# Altium schematic sheet RadYaab_v1.SchDoc
size 533 x 342 mm
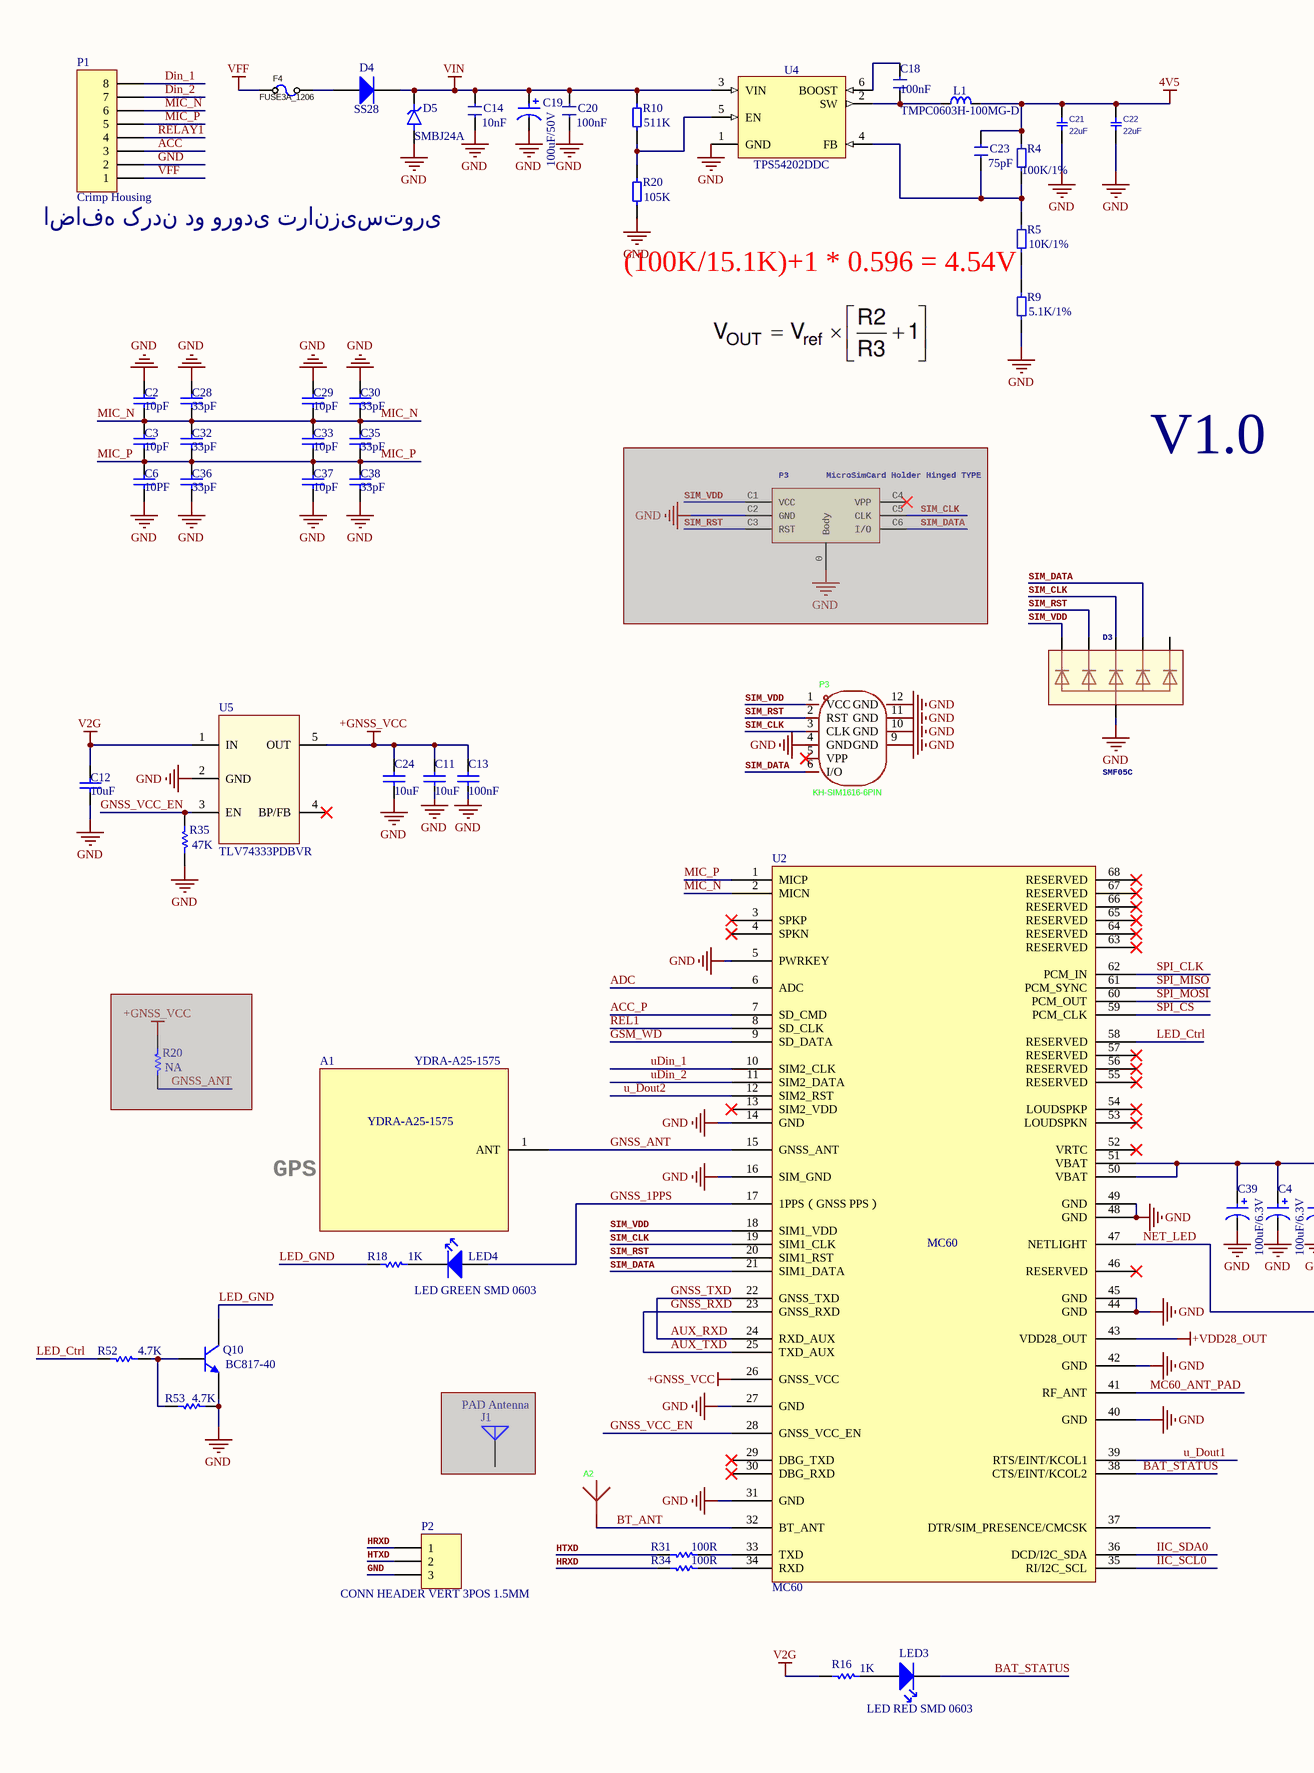
[diagram p0: RadYaab_v1.SchDoc, left]
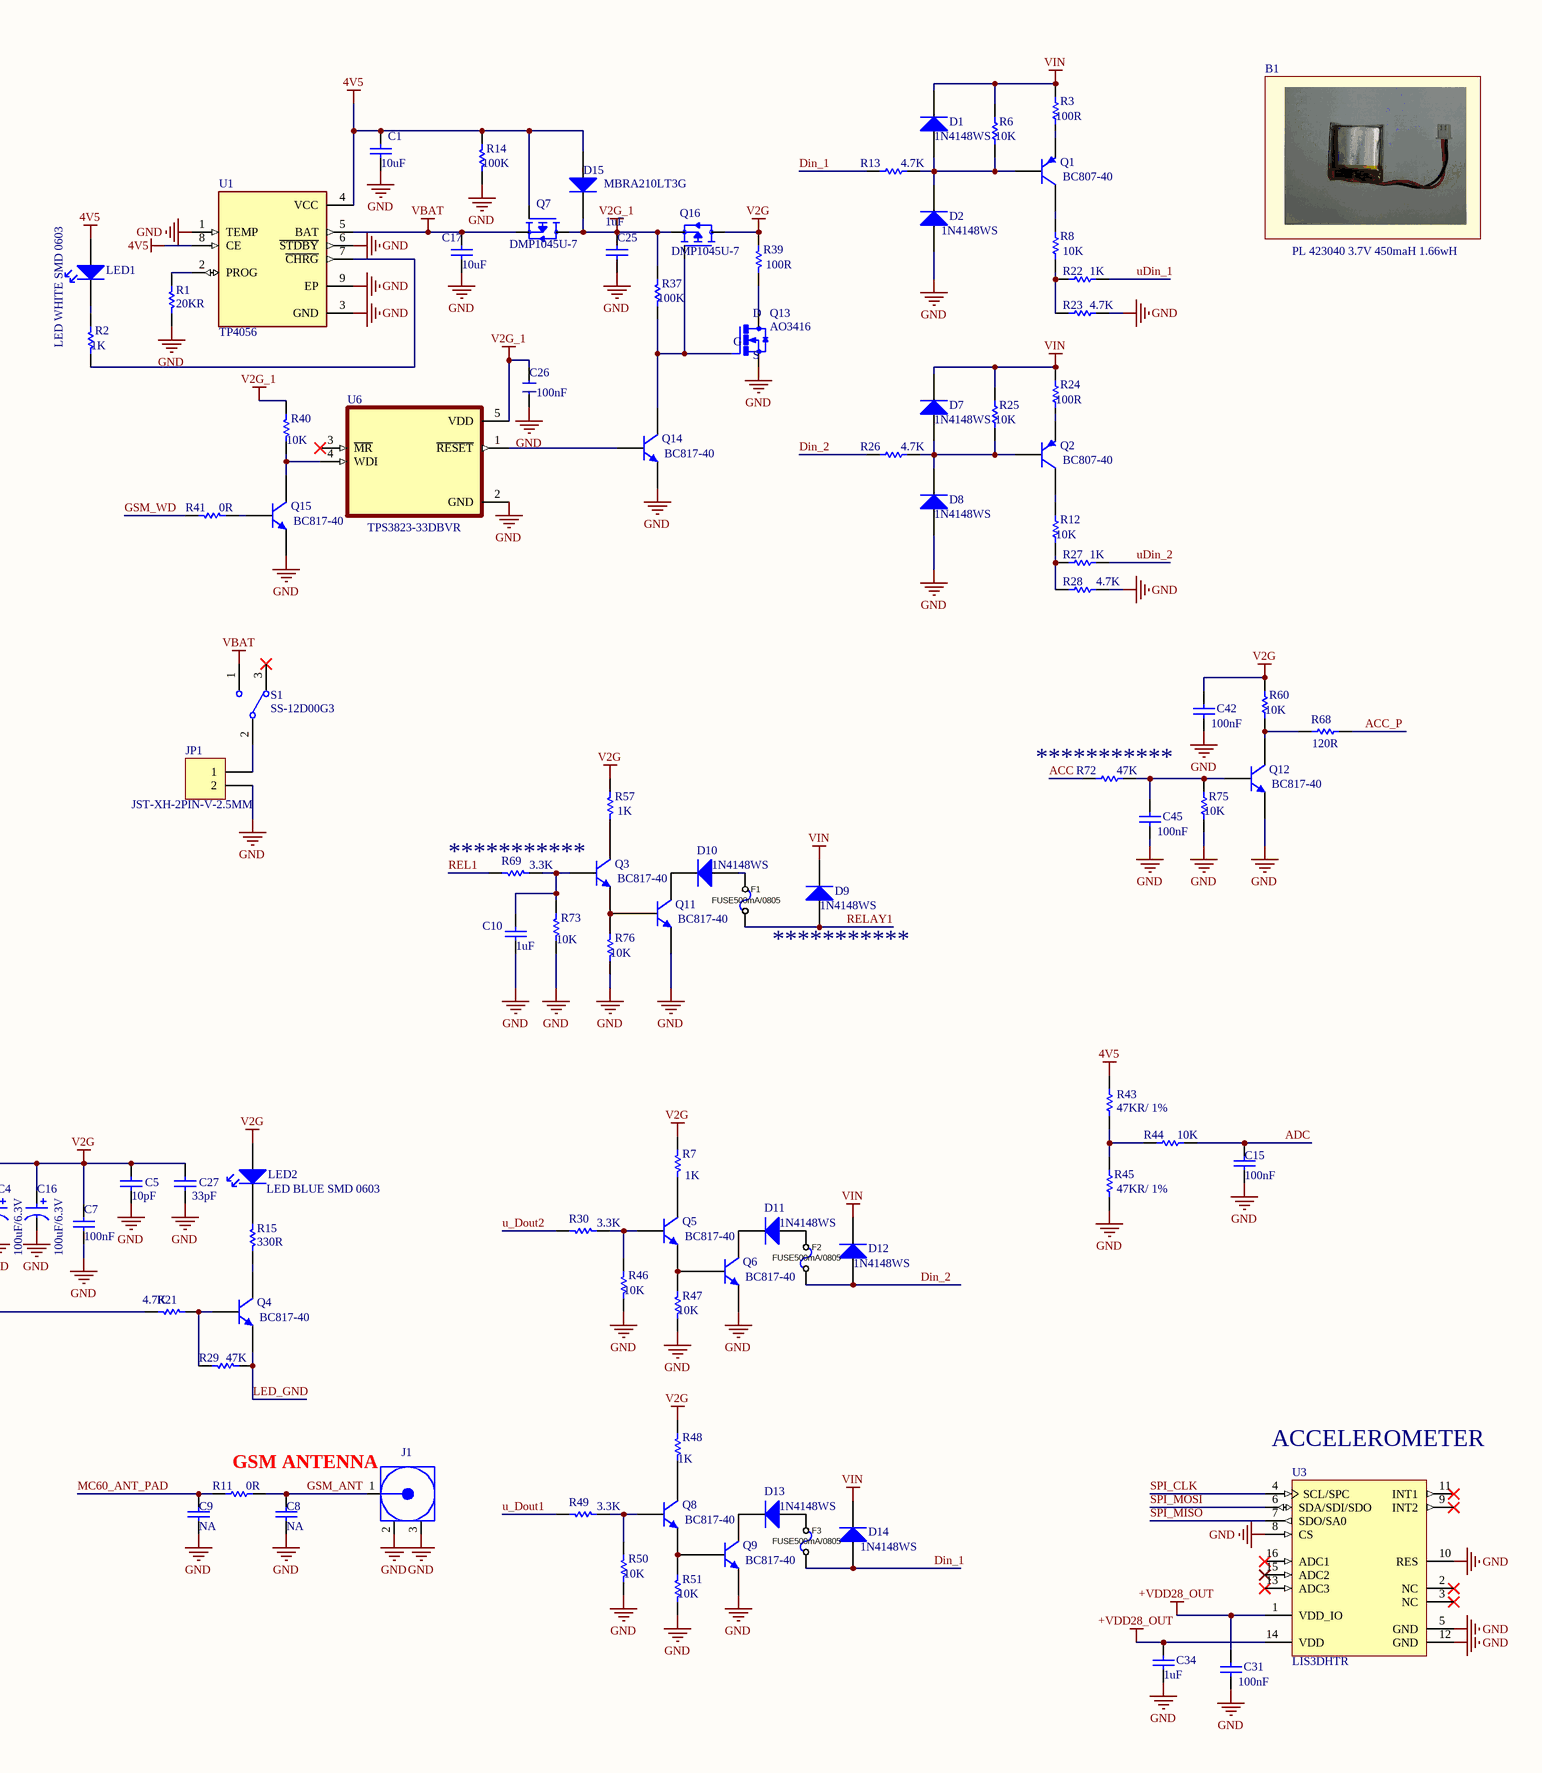
[diagram p1: RadYaab_v1.SchDoc, right]

## Parts
(Parts that share a designator on the sheet are numbered #1, #2 ... from top to bottom, then left to right.)
A1  YDRA-A25-1575  [YDRA-A25-1575]
A2  2450AT18A100E  [ANT-SMD_L3.2-W1.6]  (value not drawn)
B1  PL 423040 3.7V 450maH 1.66wH  [3.7V-450mAh]
C1  10uF  [C_0603 (1608 Metric)]
C2  10pF  [C_0603 (1608 Metric)]
C3  10pF  [C_0603 (1608 Metric)]
C4  100uF/6.3V  [Tantalum-B]
C5  10pF  [C_0603 (1608 Metric)]
C6  10PF  [C_0603 (1608 Metric)]
C7  100nF  [C_0603 (1608 Metric)]
C8  NA  [C0402]  (no BOM)
C9  NA  [C0402]  (no BOM)
C10  1uF  [C_0603 (1608 Metric)]
C11  10uF  [C_0805 (2012 Metric)]
C12  10uF  [C_0805 (2012 Metric)]
C13  100nF  [C_0603 (1608 Metric)]
C14  10nF  [C_0603 (1608 Metric)]
C15  100nF  [C_0603 (1608 Metric)]
C16  100uF/6.3V  [Tantalum-B]
C17  10uF  [C_0603 (1608 Metric)]
C18  100nF  [C_0603 (1608 Metric)]
C19  100uF/50V  [CAP-16-5-3.5MM]
C20  100nF  [C_0603 (1608 Metric)]
C21  22uF  [C1206E]
C22  22uF  [C1206E]
C23  75pF  [C_0603 (1608 Metric)]
C24  10uF  [C_0805 (2012 Metric)]
C25  1uF  [C_0603 (1608 Metric)]
C26  100nF  [C_0603 (1608 Metric)]
C27  33pF  [C_0603 (1608 Metric)]
C28  33pF  [C_0603 (1608 Metric)]
C29  10pF  [C_0603 (1608 Metric)]
C30  33pF  [C_0603 (1608 Metric)]
C31  100nF  [C_0603 (1608 Metric)]
C32  33pF  [C_0603 (1608 Metric)]
C33  10pF  [C_0603 (1608 Metric)]
C34  1uF  [C_0603 (1608 Metric)]
C35  33pF  [C_0603 (1608 Metric)]
C36  33pF  [C_0603 (1608 Metric)]
C37  10pF  [C_0603 (1608 Metric)]
C38  33pF  [C_0603 (1608 Metric)]
C39  100uF/6.3V  [Tantalum-B]
C42  100nF  [C_0603 (1608 Metric)]
C45  100nF  [C_0603 (1608 Metric)]
D1  1N4148WS  [D_SOD123W]
D2  1N4148WS  [D_SOD123W]
D3  SMF05C  [SOT363]
D4  SS28  [DO-214AA]
D5  SMBJ24A  [DIOM5436X261N]
D7  1N4148WS  [D_SOD123W]
D8  1N4148WS  [D_SOD123W]
D9  1N4148WS  [D_SOD123W]
D10  1N4148WS  [D_SOD123W]
D11  1N4148WS  [D_SOD123W]
D12  1N4148WS  [D_SOD123W]
D13  1N4148WS  [D_SOD123W]
D14  1N4148WS  [D_SOD123W]
D15  MBRA210LT3G  [DO-214AC]
F1  FUSE500mA/0805  [F0805]
F2  FUSE500mA/0805  [F0805]
F3  FUSE500mA/0805  [F0805]
F4  FUSE3A_1206  [F1206]
J1#1  PAD Antenna  [Bluetooth_ANT]  (no BOM)  (masked out: inside a compile mask, not in the netlist)
J1#2  636101111001  [63610111x001]  (value not drawn)
JP1  JST-XH-2PIN-V-2.5MM  [BT-CON]  (no BOM)
L1  TMPC0603H-100MG-D  [IND-SMD_L7.3-W6.6]
LED1  LED WHITE SMD 0603  [LED-0603 (1608 Metric)]
LED2  LED BLUE SMD 0603  [LED-0603 (1608 Metric)]
LED3  LED RED SMD 0603  [LED-0603 (1608 Metric)]
LED4  LED GREEN SMD 0603  [LED-0603 (1608 Metric)]
P1  Crimp Housing  [CON-8]
P2  CONN HEADER VERT 3POS 1.5MM  [JST_ZH_3Pin_150mm]
P3#1  MicroSimCard Holder Hinged TYPE  [MicroSimCard_Holder_Hinged]  (masked out: inside a compile mask, not in the netlist)
P3#2  KH-SIM1616-6PIN  [MICRO-SIM-SMD_KH-SIM1616-6PIN]
Q1  BC807-40  [SOT-23-3]
Q2  BC807-40  [SOT-23-3]
Q3  BC817-40  [SOT-23-3]
Q4  BC817-40  [SOT-23-3]
Q5  BC817-40  [SOT-23-3]
Q6  BC817-40  [SOT-23-3]
Q7  DMP1045U-7  [SOT95P237X112-3N]
Q8  BC817-40  [SOT-23-3]
Q9  BC817-40  [SOT-23-3]
Q10  BC817-40  [SOT-23-3]
Q11  BC817-40  [SOT-23-3]
Q12  BC817-40  [SOT-23-3]
Q13  AO3416  [SOT23-3]
Q14  BC817-40  [SOT-23-3]
Q15  BC817-40  [SOT-23-3]
Q16  DMP1045U-7  [SOT95P237X112-3N]
R1  20KR  [R_0603 (1608 Metric)]
R2  1K  [R_0603 (1608 Metric)]
R3  100R  [R_0603 (1608 Metric)]
R4  100K/1%  [R_0603 (1608 Metric)]
R5  10K/1%  [R_0603 (1608 Metric)]
R6  10K  [R_0603 (1608 Metric)]
R7  1K  [R_0603 (1608 Metric)]
R8  10K  [R_0603 (1608 Metric)]
R9  5.1K/1%  [R_0603 (1608 Metric)]
R10  511K  [R_0603 (1608 Metric)]
R11  0R  [R0402]
R12  10K  [R_0603 (1608 Metric)]
R13  4.7K  [R_0603 (1608 Metric)]
R14  100K  [R_0603 (1608 Metric)]
R15  330R  [R_0603 (1608 Metric)]
R16  1K  [R_0603 (1608 Metric)]
R18  1K  [R_0603 (1608 Metric)]
R20#1  105K  [R_0603 (1608 Metric)]
R20#2  NA  [R_0603 (1608 Metric)]  (no BOM)  (masked out: inside a compile mask, not in the netlist)
R21  4.7K  [R_0603 (1608 Metric)]
R22  1K  [R_0603 (1608 Metric)]
R23  4.7K  [R_0603 (1608 Metric)]
R24  100R  [R_0603 (1608 Metric)]
R25  10K  [R_0603 (1608 Metric)]
R26  4.7K  [R_0603 (1608 Metric)]
R27  1K  [R_0603 (1608 Metric)]
R28  4.7K  [R_0603 (1608 Metric)]
R29  47K  [R_0603 (1608 Metric)]
R30  3.3K  [R_0603 (1608 Metric)]
R31  100R  [R_0603 (1608 Metric)]
R34  100R  [R_0603 (1608 Metric)]
R35  47K  [R_0603 (1608 Metric)]
R37  100K  [R_0603 (1608 Metric)]
R39  100R  [R0805]
R40  10K  [R_0603 (1608 Metric)]
R41  0R  [R_0603 (1608 Metric)]
R43  47KR/ 1%  [R_0603 (1608 Metric)]
R44  10K  [R_0603 (1608 Metric)]
R45  47KR/ 1%  [R_0603 (1608 Metric)]
R46  10K  [R_0603 (1608 Metric)]
R47  10K  [R_0603 (1608 Metric)]
R48  1K  [R_0603 (1608 Metric)]
R49  3.3K  [R_0603 (1608 Metric)]
R50  10K  [R_0603 (1608 Metric)]
R51  10K  [R_0603 (1608 Metric)]
R52  4.7K  [R_0603 (1608 Metric)]
R53  4.7K  [R_0603 (1608 Metric)]
R57  1K  [R_0603 (1608 Metric)]
R60  10K  [R_0603 (1608 Metric)]
R68  120R  [R_0603 (1608 Metric)]
R69  3.3K  [R_0603 (1608 Metric)]
R72  47K  [R_0603 (1608 Metric)]
R73  10K  [R_0603 (1608 Metric)]
R75  10K  [R_0603 (1608 Metric)]
R76  10K  [R_0603 (1608 Metric)]
S1  SS-12D00G3  [SW-TH_SS-12D01-GX]
U1  TP4056  [SOP127P600X175-9N]
U2  MC60  [MOD-54_ExtraPins]
U3  LIS3DHTR  [PQFN50P300X300X79-16N]
U4  TPS54202DDC  [SOT95P280X100-6N]
U5  TLV74333PDBVR  [SOT23-5]
U6  TPS3823-33DBVR  [SOT95P280X145-5N]

## Nets
4V5: C1.2 C21.2 C22.2 C23.2 D15.1(A) L1.2 LED1.1(A) Q7.1(G) R4.1 R14.1 R43.2 U1.4(VCC) U1.8(CE)
+GNSS_VCC: C11.2 C13.2 C24.2 U2.26(GNSS_VCC) U5.5(OUT)
+VDD28_OUT: C31.2 C34.2 U2.43(VDD28_OUT) U3.1(VDD_IO) U3.14(VDD)
GND: C1.1 C2.1 C4.2 C5.1 C6.2 C7.1 C8.1 C9.1 C10.1 C11.1 C12.1 C13.1 C14.1 C15.1 C16.2 C17.1 C19.2 C20.1 C21.1 C22.1 C24.1 C25.1 C26.2 C27.1 C28.1 C29.1 C30.1 C31.1 C34.1 C36.2 C37.2 C38.2 C39.2 C42.1 C45.1 D2.1(A) D3.2(A) D5.A D8.1(A) J1#2.2(GND) J1#2.3(GND) JP1.2 P1.2 P2.3 P3#2.4(GND) P3#2.9(GND) P3#2.10(GND) P3#2.11(GND) P3#2.12(GND) Q6.2(E) Q9.2(E) Q10.2(E) Q11.2(E) Q12.2(E) Q13.2(S) Q14.2(E) Q15.2(E) R1.1 R9.2 R14.2 R20#1.2 R23.1 R28.1 R35.2 R45.1 R46.1 R47.1 R50.1 R51.1 R53.1 R73.1 R75.2 R76.1 U1.1(TEMP) U1.3(GND) U1.6(~{STDBY}) U1.9(EP) U2.5(PWRKEY) U2.14(GND) U2.16(SIM_GND) U2.27(GND) U2.31(GND) U2.40(GND) U2.42(GND) U2.44(GND) U2.45(GND) U2.48(GND) U2.49(GND) U3.5(GND) U3.8(CS) U3.10(RES) U3.12(GND) U4.1(GND) U5.2(GND) U6.2(GND)
V2G: C4.1 C5.2 C7.2 C12.2 C16.1 C27.2 C39.1 C42.2 LED2.1(A) Q16.3(D) R7.2 R16.1 R39.2 R48.2 R57.2 R60.2 U2.50(VBAT) U2.51(VBAT) U5.1(IN)
V2G_1: C25.2 C26.1 D15.2(K) Q7.3(D) Q16.2(S) R37.2 R40.2 U6.5(VDD)
VBAT: C17.2 Q7.2(S) S1.1 U1.5(BAT)
VFF: F4.1 P1.1
VIN: C14.2 C19.1 C20.2 D1.2(K) D4.2(K) D5.C D7.2(K) D9.2(K) D12.2(K) D14.2(K) R3.2 R6.1 R10.1 R24.2 R25.1 U4.3(VIN)
ACC: P1.3 R72.2
ACC_P: R68.2 U2.7(SD_CMD)
ADC: C15.2 R44.2 U2.6(ADC)
AUX_RXD: U2.22(GNSS_TXD) U2.24(RXD_AUX)  [also labelled GNSS_TXD]
AUX_TXD: U2.23(GNSS_RXD) U2.25(TXD_AUX)  [also labelled GNSS_RXD]
BAT_STATUS: LED3.2(K) U2.38(CTS/EINT/KCOL2)
BT_ANT: A2.1(ANT) U2.32(BT_ANT)
Din_1: D14.1(A) F3.1 P1.8 R13.2
Din_2: D12.1(A) F2.1 P1.7 R26.2
GNSS_1PPS: LED4.1(A) U2.17(1PPS（GNSS_PPS）)
GNSS_ANT: A1.1(ANT) U2.15(GNSS_ANT)
GNSS_VCC_EN: R35.1 U2.28(GNSS_VCC_EN) U5.3(EN)
GSM_ANT: C8.2 J1#2.1(Signal) R11.1
GSM_WD: R41.2 U2.9(SD_DATA)
HRXD: P2.1 R34.2
HTXD: P2.2 R31.2
IIC_SCL0: U2.35(RI/I2C_SCL)
IIC_SDA0: U2.36(DCD/I2C_SDA)
LED_Ctrl: R52.2 U2.58(RESERVED)
LED_GND: Q4.2(E) Q10.3(C) R18.2 R29.1
MC60_ANT_PAD: C9.2 R11.2 U2.41(RF_ANT)
MIC_N: C2.2 C3.2 C28.2 C29.2 C30.2 C32.2 C33.2 C35.2 P1.6 U2.2(MICN)
MIC_P: C3.1 C6.1 C32.1 C33.1 C35.1 C36.1 C37.1 C38.1 P1.5 U2.1(MICP)
NET_LED: R21.2 U2.47(NETLIGHT)
REL1: R69.1 U2.8(SD_CLK)
RELAY1: D9.1(A) F1.1 P1.4
SIM_CLK: D3.4(C3) P3#2.3(CLK) U2.19(SIM1_CLK)
SIM_DATA: D3.5(C4) P3#2.6(I/O) U2.21(SIM1_DATA)
SIM_RST: D3.3(C2) P3#2.2(RST) U2.20(SIM1_RST)
SIM_VDD: D3.1(C1) P3#2.1(VCC) U2.18(SIM1_VDD)
SPI_CLK: U2.62(PCM_IN) U3.4(SCL/SPC)
SPI_CS: U2.59(PCM_CLK)
SPI_MISO: U2.61(PCM_SYNC) U3.7(SDO/SA0)
SPI_MOSI: U2.60(PCM_OUT) U3.6(SDA/SDI/SDO)
u_Dout1: R49.1 U2.39(RTS/EINT/KCOL1)
u_Dout2: R30.1 U2.12(SIM2_RST)
uDin_1: R22.2 U2.10(SIM2_CLK)
uDin_2: R27.2 U2.11(SIM2_DATA)
NetC10_2: C10.2 Q3.1(B) R69.2 R73.2
NetC18_1: C18.1 U4.6(BOOST)
NetC18_2: C18.2 L1.1 U4.2(SW)
NetC23_1: C23.1 R4.2 R5.1 U4.4(FB)
NetC45_2: C45.2 Q12.1(B) R72.1 R75.1
NetD1_1: D1.1(A) D2.2(K) Q1.1(B) R6.2 R13.1
NetD4_1: D4.1(A) F4.2
NetD7_1: D7.1(A) D8.2(K) Q2.1(B) R25.2 R26.1
NetD10_1: D10.1(A) F1.2
NetD10_2: D10.2(K) Q11.3(C)
NetD11_1: D11.1(A) F2.2
NetD11_2: D11.2(K) Q6.3(C)
NetD13_1: D13.1(A) F3.2
NetD13_2: D13.2(K) Q9.3(C)
NetJP1_1: JP1.1 S1.2
NetLED1_2: LED1.2(K) R2.1
NetLED2_2: LED2.2(K) R15.1
NetLED3_1: LED3.1(A) R16.2
NetLED4_2: LED4.2(K) R18.1
NetQ1_2: Q1.2(E) R3.1
NetQ1_3: Q1.3(C) R8.2
NetQ2_2: Q2.2(E) R24.1
NetQ2_3: Q2.3(C) R12.2
NetQ3_2: Q3.2(E) Q11.1(B) R76.2
NetQ3_3: Q3.3(C) R57.1
NetQ4_1: Q4.1(B) R21.1 R29.2
NetQ4_3: Q4.3(C) R15.2
NetQ5_1: Q5.1(B) R30.2 R46.2
NetQ5_2: Q5.2(E) Q6.1(B) R47.2
NetQ5_3: Q5.3(C) R7.1
NetQ8_1: Q8.1(B) R49.2 R50.2
NetQ8_2: Q8.2(E) Q9.1(B) R51.2
NetQ8_3: Q8.3(C) R48.1
NetQ10_1: Q10.1(B) R52.1 R53.2
NetQ12_3: Q12.3(C) R60.1 R68.1
NetQ13_1: Q13.1(G) Q14.3(C) Q16.1(G) R37.1
NetQ13_3: Q13.3(D) R39.1
NetQ14_1: Q14.1(B) U6.1(~{RESET})
NetQ15_1: Q15.1(B) R41.1
NetQ15_3: Q15.3(C) R40.1 U6.4(WDI)
NetR1_2: R1.2 U1.2(PROG)
NetR2_2: R2.2 U1.7(~{CHRG})
NetR5_2: R5.2 R9.1
NetR8_1: R8.1 R22.1 R23.2
NetR10_2: R10.2 R20#1.1 U4.5(EN)
NetR12_1: R12.1 R27.1 R28.2
NetR31_1: R31.1 U2.33(TXD)
NetR34_1: R34.1 U2.34(RXD)
NetR43_1: R43.1 R44.1 R45.2

Not connected (* = marked no-connect by the designer): A2 2; D3 6(C5); P3#2 5(VPP)*; S1 3*; U2 3(SPKP)* 4(SPKN)* 13(SIM2_VDD)* 29(DBG_TXD)* 30(DBG_RXD)* 37(DTR/SIM_PRESENCE/CMCSK) 46(RESERVED)* 52(VRTC)* 53(LOUDSPKN)* 54(LOUDSPKP)* 55(RESERVED)* 56(RESERVED)* 57(RESERVED)* 63(RESERVED)* 64(RESERVED)* 65(RESERVED)* 66(RESERVED)* 67(RESERVED)* 68(RESERVED)*; U3 2(NC)* 3(NC)* 9(INT2)* 11(INT1)* 13(ADC3)* 15(ADC2)* 16(ADC1)*; U5 4(BP/FB)*; U6 3(~{MR})*

## Notes on the sheet
- (near P1) اضافه کردن دو ورودی ترانزیستوری
- (near R5) (100K/15.1K)+1 * 0.596 = 4.54V
- V1.0
- (near R72) ***********
- (near R69) ***********
- ***********
- GPS Antenna
- GSM ANTENNA
- (near U3) ACCELEROMETER

## Library data of the parts
A1 = YDRA-A25-1575: 25x25mm GPS ceramic patch antenna; Manufacturer: Amotech; Board Qty: 1000; Current Footprint: NULL; PCB Name: GS-101; HelpURL: D:\HNA\ALTIUM2009\GS-101\DOC\Datasheet_YDRA-A25-1575 (Rev 0).pdf; Part Number: YDRA-A25-1575; ITEM/NO: NULL; Manufacturer Part Number: NULL; Package / Case: NULL; Pricing: NULL; Size / Dimension: NULL; Supplier: NULL; Supplier Part Number: NULL
A2 = 2450AT18A100E: Manufacturer: JOHANSON(约翰逊); Add into BOM: yes; Antenna Type: 2.4G天线; Central Frequency: 2.4GHz; Peak Gain: 0.5dBi; Impedance: 50Ω; Power capacity: 2W; Symbol: 2450AT18A100E; Device: 2450AT18A100E; LCSC Part Name: 2.4G天线; Supplier Part: C89334; Manufacturer Part: 2450AT18A100E; Supplier Footprint: 1206; JLCPCB Part Class: Extended Part; Datasheet: https://atta.szlcsc.com/upload/public/pdf/source/20180301/C89334_15198946260391384223.pdf; Supplier: LCSC; Convert to PCB: yes; Bandwidth: -; Polarization Type: -; VSWR: -; Operating Temperature: -40℃~+125℃
B1 = Battery 3.7V 1000mah: Battery 3.7V 450mAh with PCB Rechargeable Li-Polymer Battery; Board Qty: 1000; Current Footprint: NULL; PCB Name: GS-101; Part Number: PL 423040 3.7V 450maH 1.66wH; ITEM/NO: NULL; Manufacturer Part Number: NULL; Package / Case: NULL; Pricing: NULL; Size / Dimension: 29.5MM*38MM*4MM; Supplier: NULL; Supplier Part Number: NULL; Manufacturer: NULL
C1 C11 C17 C24 = Cap_SMD: Chip Monolithic Ceramic Capacitor; SMD; Manufacturer: Vishay or Panasonic; Manufacturer Part Number: NULL; Current Footprint: 0805 (2012 Metric); Board Qty: 1000; PCB Name: GS-101; ITEM/NO: 23; Package / Case: 0805 (2012 Metric); Part Number: 10uF; Pricing: NULL; Size / Dimension: NULL; Supplier: NULL; Supplier Part Number: NULL
C2 C6 C28-C30 C36-C38 = Cap: Chip Monolithic Ceramic Capacitor; SMD; Manufacturer: Vishay or Panasonic; Manufacturer Part Number: NULL; Board Qty: 1000; Current Footprint: 0603 (1608 Metric); PCB Name: GS-101; ITEM/NO: 35; ComponentLink1Description: Datasheet; ComponentLink1URL: D:\HNA\Datasheet Documents\KEM_C1002_X7R_SMD.pdf; Description1: Chip Monolithic Ceramic Capacitor; SMD; HelpURL: D:\HNA\Datasheet Documents\KEM_C1002_X7R_SMD.pdf; Mounting Type: Surface Mount; Package / Case: 0603 (1608 Metric); Pricing: NULL; Supplier: NULL; Supplier Part Number: NULL; Size / Dimension: NULL
  C2 C6 C29 C37: Part Number: 10PF
  C28 C30 C36 C38: Part Number: 33PF
C3 C32 C33 C35 = Cap: Chip Monolithic Ceramic Capacitor; SMD; Manufacturer: Vishay or Panasonic; Manufacturer Part Number: NULL; Board Qty: 1000; Current Footprint: 0603 (1608 Metric); PCB Name: GS-101; ITEM/NO: 46; ComponentLink1Description: Datasheet; ComponentLink1URL: D:\HNA\Datasheet Documents\KEM_C1002_X7R_SMD.pdf; Description1: Chip Monolithic Ceramic Capacitor; SMD; HelpURL: D:\HNA\Datasheet Documents\KEM_C1002_X7R_SMD.pdf; Mounting Type: Surface Mount; Package / Case: 0603 (1608 Metric); Pricing: NULL; Supplier: NULL; Supplier Part Number: NULL; Size / Dimension: NULL
  C3 C33: Part Number: 10PF
  C32 C35: Part Number: 33PF
C4 C16 C39 = Cap Pol SMD: CAP TANT 22UF 10% 16V SMD; Manufacturer: AVX Corporation; Manufacturer Part Number: TAJB226K016RNJ; Manufacturer Size Code: B; Current Footprint: 1411 (3528 Metric), 1210; Board Qty: 1000; Type: Molded; ESR (Equivalent Series Resistance): 2.3 Ohm; Notification: Current market demand for these product types have resulted in fluctuating and extending lead times. Lead times may differ.; ITEM/NO: NULL; PCB Name: GS-101; Part Number: 100uF/6.3V; HelpURL: D:\HNA\Datasheet Documents\TAJ.pdf; Supplier 1: Digi-Key; Supplier Part Number 1: 478-1682-2-ND; RoHS: RoHS Compliant; Category: Capacitors; Stock 1: 84000; Pricing 1: 2000=0.1344, 4000=0.126, 10000=0.1176, 14000=0.116 (USD); Packaging: Tape & Reel (TR); Part Status: Active; Tolerance: ±10%; Operating Temperature: -55°C ~ 125°C; Lifetime @ Temp.: -; Mounting Type: Surface Mount; Package / Case: 1411 (3528 Metric), 1210; Size / Dimension: 0.138" L x 0.110" W (3.50mm x 2.80mm); Height - Seated (Max): 0.083" (2.10mm); Lead Spacing: -; Features: General Purpose; Failure Rate: -; ComponentLink1URL: http://datasheets.avx.com/TAJ.pdf; ComponentLink1Description: http://datasheets.avx.com/TAJ.pdf; Pricing: NULL; Supplier: NULL; Supplier Part Number: NULL; Parameter 1: *
C5 C8-C10 C12 C25 C27 C31 C42 C45 = Cap: Chip Monolithic Ceramic Capacitor; SMD; Manufacturer: NULL; Current Footprint: 0603 (1608 Metric); Board Qty: 1000; PCB Name: GS-101; ITEM/NO: 44; Manufacturer Part Number: NULL; Package / Case: 0603 (1608 Metric); Pricing: NULL; Size / Dimension: NULL; Supplier: NULL; Supplier Part Number: NULL
  C5: Part Number: 10pF
  C8 C9: Part Number: NA
  C10 C25: Part Number: 1uF
  C12: Part Number: 10uF
  C27: Part Number: 33pF
  C31 C42 C45: Part Number: 100nF
C7 = Cap: Chip Monolithic Ceramic Capacitor; SMD; Manufacturer: Vishay or Panasonic; Manufacturer Part Number: NULL; Board Qty: 1000; Current Footprint: 0603 (1608 Metric); PCB Name: GS-101; ITEM/NO: 44; Part Number: 100nF; ComponentLink1Description: Datasheet; ComponentLink1URL: D:\HNA\Datasheet Documents\KEM_C1002_X7R_SMD.pdf; Description1: Chip Monolithic Ceramic Capacitor; SMD; HelpURL: D:\HNA\Datasheet Documents\KEM_C1002_X7R_SMD.pdf; Mounting Type: Surface Mount; Package / Case: 0603 (1608 Metric); Pricing: NULL; Supplier: NULL; Supplier Part Number: NULL; Size / Dimension: NULL
C13 C15 = Cap_SMD: Chip Monolithic Ceramic Capacitor; SMD; Manufacturer: Vishay or Panasonic; Manufacturer Part Number: NULL; Current Footprint: 0603 (1608 Metric); Board Qty: 1000; PCB Name: GS-101; ITEM/NO: 44; Package / Case: 0603 (1608 Metric); Part Number: 100nF; Pricing: NULL; Size / Dimension: NULL; Supplier: NULL; Supplier Part Number: NULL
C14 C18 C20 C23 C26 = Capacitor SMD
  C14: Value: 10nF
  C18 C20 C26: Value: 100nF
  C23: Value: 75pF
C19 = Cap Pol THD: CAP ALUM 100UF 20% 50V RADIAL; Manufacturer: KEMET; Manufacturer Part Number: ESY107M050AG3AA; Current Footprint: Radial, Can; Board Qty: 1000; PCB Name: GS-101; ESR (Equivalent Series Resistance): 74 mOhm @ 100kHz; Lifetime @ Temp.: 3000 Hrs @ 105°C; Polarization: Polar; ITEM/NO: NULL; Part Number: 100uF/50V; Lead Spacing: 0.295" (7.50mm); HelpURL: D:\HNA\Datasheet Documents\ESY107M050AG3AA.pdf; Supplier 1: Digi-Key; Supplier Part Number 1: 399-6119-ND; RoHS: RoHS Compliant; Category: Capacitors; Stock 1: 5937; Pricing 1: 1=0.34, 10=0.235, 100=0.1411, 500=0.10584, 1000=0.08938, 2500=0.08467, 5000=0.07997 (USD); Packaging: Bulk; Part Status: Active; Tolerance: ±20%; Operating Temperature: -40°C ~ 105°C; Ratings: -; Applications: General Purpose; Size / Dimension: 0.315" Dia (8.00mm); Height - Seated (Max): 0.492" (12.50mm); Surface Mount Land Size: -; Mounting Type: Through Hole; Package / Case: Radial, Can; ComponentLink1URL: https://search.kemet.com/component-edge/download/specsheet/ESY107M050AG3AA.pdf; ComponentLink1Description: https://search.kemet.com/component-edge/download/specsheet/ESY107M050AG3AA.pdf; Pricing: NULL; Supplier: NULL; Supplier Part Number: NULL
C21 C22 = CAP_SMD_MLCC_22u25V: CAP, MLCC, X5R 22uF 25V 20% 1206; PARAM: X5R, 20%; MANF_P#: TMK316BBJ226ML-T; MANF: Taiyo Yuden; DESC: CAP, MLCC, 22uF, 25V, X5R,  20%, 1206; PARAM2: 25V; PRICE: 0.572$; VALUE: 22uF
C34 = Cap: Chip Monolithic Ceramic Capacitor; SMD; Manufacturer: NULL; Current Footprint: 0603 (1608 Metric); Board Qty: 1000; PCB Name: GS-101; ITEM/NO: 13; Manufacturer Part Number: NULL; Package / Case: 0603 (1608 Metric); Part Number: 1uF; Pricing: NULL; Size / Dimension: NULL; Supplier: NULL; Supplier Part Number: NULL
D1 D2 D7-D14 = Diode 1N4148: DIODE SMALL SIG 100V 0.2A SOD80; Manufacturer: Fairchild Semiconductor; Manufacturer Part Number: LL4148; Part Picture: D:\HNA\Electrinic Part Pictures\SOD-80.bmp; Current Footprint: SOD-80; Assembly Status: A; PCB Project: FL3 Controller; Board Qty: 1000; in stock Qty: 0; Repository Qty: 55; ITEM/NO: 92; PCB Name: GS-101; ComponentLink1Description: Datasheet; ComponentLink1URL: D:\HNA\Datasheet Documents\LL4148.pdf; Description1: DIODE SMALL SIG 100V 0.2A SOD80; HelpURL: D:\HNA\Datasheet Documents\LL4148.pdf; Main Supplier: Ocean Electronic (Int'L) Limited--(http://www.iic-ic.com); Mounting Type: Surface Mount; Package / Case: SOD-80; Packaging Part: ?; Part Number: 1N4148W; Pricing: 1=0.1, 10=0.068, 25=0.062, 100=0.0445, 250=0.0262, 500=0.02174, 1000=0.01483 (USD); SHOP NAME: ?; Size / Dimension: NULL; Supplier: Digi-Key; Supplier Part Number: LL4148FSCT-ND
D3 = TVSARRAY_5LANE: Voltage Transient Suppressor ArraySOT363; GateName_1: G$1; SymbolName_1: TVSARRAY_5LANE; LibraryName: microbuilder; DeviceSetName: TVSARRAY_5LANE
D4 = Diode SS24: DIODE SCHOTTKY 40V 2A DO214AA; Manufacturer: Fairchild Semiconductor; Current Footprint: DO-214AA, SMB; Board Qty: 1000; PCB Name: GS-101; ITEM/NO: 115; Manufacturer Part Number: SS28; Mounting Type: Surface Mount; Package / Case: DO-214AA, SMB; Pricing: 1=0.48, 10=0.364, 100=0.2266, 500=0.1549, 1000=0.11907 (USD); Part Number: SS28; Size / Dimension: NULL; HelpURL: D:\HNA\Datasheet Documents\S210 (1).pdf; Supplier 1: Digi-Key; Supplier Part Number 1: SS28TR-ND; Supplier: NULL; Supplier Part Number: NULL
D5 = SMBJ24A: 24V TVS Diode; MF: STMicroelectronics; MP: SMBJ24A-TR; SnapEDA_Link: https://www.snapeda.com/parts/SMBJ24A-TR/STMicroelectronics/view-part/?ref=snap; Package: DO-214 STMicroelectronics; Value: *; Check_prices: https://www.snapeda.com/parts/SMBJ24A-TR/STMicroelectronics/view-part/?ref=eda
D15 = Diode SS24: DIODE SCHOTTKY 10V 2A SMA; Manufacturer: ON Semiconductor; Current Footprint: DO-214AC, SMA; Speed: Fast Recovery =< 500ns, > 200mA (Io); Board Qty: 1000; ITEM/NO: NULL; PCB Name: GS-101; Part Number: MBRA210LT3G; HelpURL: D:\HNA\Datasheet Documents\MBRA210LT3-D.PDF; Supplier 1: Digi-Key; Supplier Part Number 1: MBRA210LT3GOSTR-ND; Manufacturer Part Number: MBRA210LT3G; RoHS: RoHS Compliant; Category: Discrete Semiconductor Products; Stock 1: 20000; Pricing 1: 5000=0.17705, 10000=0.16484, 25000=0.15629 (USD); Packaging: Tape & Reel (TR); Part Status: Active; Diode Type: Schottky; Current - Average Rectified (Io): 2A; Capacitance @ Vr, F: -; Mounting Type: Surface Mount; Package / Case: DO-214AC, SMA; Supplier Device Package: SMA; Operating Temperature - Junction: -55°C ~ 125°C; Base Part Number: MBRA210; ComponentLink1URL: http://www.onsemi.com/pub/Collateral/MBRA210LT3-D.PDF; ComponentLink1Description: http://www.onsemi.com/pub/Collateral/MBRA210LT3-D.PDF; Pricing: NULL; Size / Dimension: NULL; Supplier: NULL; Supplier Part Number: NULL
F1-F3 = FUSE_500mA_0805_FAST: Fuse, 500mA, 32VDC, 0805, SMD, Fast Acting; PARAM: 500mA; 32VDC; fast acting; MANF_P#: MANF_PART#; PARAM2: 0.25 Ohm DC Cold Resistance; MANF: MANF
  F1 F3: VALUE: FUSE500mA
  F2: VALUE: FUSE500mA/0805
F4 = FUSE_3A_1206_SLOW: Fuse, 3A, 32VDC, 1206, SMD, Slow Blow; PARAM: 3A; 32VDC; Slow Blow; MANF: Bourns; MANF_P#: SF-1206SP300-2; PARAM2: 0.027Ohm; PRICE: 0.9$; VALUE: FUSE3A_1206
J1#1 = Antenna: Generic Antenna; Part Picture: D:\HNA\Electrinic Part Pictures\C-0402.bmp; in stock Qty: 0; PCB Name: GS-101; Board Qty: 1000; Packing List: NA; Current Footprint: NULL; Description1: Generic Antenna; Size / Dimension: NULL; Supplier Link: null; Repository Qty: 0; ITEM/NO: NULL; Manufacturer Part Number: NULL; Package / Case: NULL; Pricing: NULL; Supplier: NULL; Supplier Part Number: NULL; Manufacturer: NULL
J1#2 = 636101111001: WR-UMRF PCB Receptacle SMT with 3 Pads, DC~6GHz, 50Ω; Manufacturer: Wurth Elektronik; Impedance: 50Ohm; Manufacturer Part Number: 636101111001; Category: Coaxial Connectors; Match Code: WR-UMRF; ComponentLink1Description: Website Link; ComponentLink1URL: https://www.we-online.com/redexpert/article/636101111001?ad; ComponentLink2Description: Datasheet Link; ComponentLink2URL: https://www.we-online.com/redexpert/spec/636101111001?ad; Mount: Surface Mount; Operating Temperature Max: 90°C; Operating Temperature Min: -40°C; Packaging: Tape and Reel; Frequency Range: DC~6GHz
JP1 = Header 2: CONN HEADER 2POS 2.54MM VERT T/H MALE; Manufacturer: JST Sales America Inc; Manufacturer Part Number: B2B-XH-A(LF)(SN); Current Footprint: HDR1X2; Board Qty: 1000; PCB Name: GS-101; ITEM/NO: 87; Package / Case: HDR1X2; Part Number: JST-XH-2PIN-V-2.5MM; Pricing: 1=0.14, 10=0.134, 25=0.0996, 50=0.0856, 100=0.0827, 250=0.07124, 500=0.0684, 1000=0.05985, 2500=0.05415 (USD); Size / Dimension: Number of Positions=2;Number of Rows=1;Pitch=0.098" (2.50mm);Contact Type=Male Pin; Supplier: Digi-Key; Supplier Part Number: 455-2247-ND; ComponentLink1Description: Datasheet; ComponentLink1URL: D:\HNA\Datasheet Documents\eXH.pdf; Description1: CONN HEADER 2POS 2.54MM VERT T/H MALE; HelpURL: D:\HNA\Datasheet Documents\eXH.pdf; Mounting Type: Through Hole
L1 = IND1008_1UH_20%_WURTH_74479787210B: Inductor; Part Description: Power Multilayer Inductor (WE-PMI Series); Manufacturer: WURTH ELEKTRONIK; Power: 1.95A; Resistance: 0.06R; Tolerance: ±20%; Part Number: IND1008_1UH_20%_WURTH_74479787210B; Component Kind: Standard; Component Type: Standard; Footprint: INDC2620X100N; Pin Count: 2; Value: TMPC0603H-100MG-D; Manufacturer Part Number: 74479787210B; Case: 1008; Mounted: Yes; Socket: No; SMD: Yes; Sense: No; ComponentHeight: 1mm; HelpURL: \\cern.ch\dfs\Applications\Altium\Datasheets\IND_WURTH_WE-PMI_74479787210B.pdf; Author: CERN DEM JLC; CreateDate: 10/1/2014; LatestRevisionDate: 10/1/2014
LED1-LED4 = LED_SMD: LED BLUE CLEAR 0603 SMD; Manufacturer: Inolux; Manufacturer Part Number: IN-S63AT5B; Current Footprint: 0603 (1608 Metric); Board Qty: 1000; PCB Name: GS-101; ITEM/NO: 95; Package / Case: 0603 (1608 Metric); Size / Dimension: NULL; Mounting Type: Surface Mount; ComponentLink1URL: http://optoelectronics.liteon.com/upload/download/DS22-2000-109/S_110_LTST-C171KRKT.pdf; ComponentLink1Description: http://optoelectronics.liteon.com/upload/download/DS22-2000-109/S_110_LTST-C171KRKT.pdf; Pricing: 1=0.39, 10=0.288, 100=0.1526, 250=0.108, 500=0.09216, 1000=0.072 (USD); Supplier: Digi-Key; Supplier Part Number: 1830-1061-2-ND
  LED1: Part Number: LED WHITE SMD 0603
  LED2: Part Number: LED BLUE SMD 0603
  LED3: Part Number: LED RED SMD 0603
  LED4: Part Number: LED GREEN SMD 0603
P1 = Header 8: 2.50mm Pitch, Board-In Crimp Housing, Single Row, Right-Angle and Vertical, 8 Circuits, Natural; LatestRevisionDate: 17-Jul-2002; LatestRevisionNote: Re-released for DXP Platform.; Publisher: Altium Limited
P2 = Header 3: JST ZH 1.5mm Connectors 3POS; LatestRevisionDate: 17-Jul-2002; LatestRevisionNote: Re-released for DXP Platform.; Publisher: Altium Limited
P3#1 = MicroSimCard_Holder_Hinged: GateName_1: G$1; SymbolName_1: MICROSIM; LibraryName: Connector; DeviceSetName: MICROSIM
P3#2 = KH-SIM1616-6PIN: Manufacturer: kinghelm(金航标); Add into BOM: yes; Card Connection Mode: Self bomb; Card Type: MicroSIM卡; Connector Type: Deck; Body Height (Max): 1.35mm; Symbol: KH-SIM1616-6PIN; Device: KH-SIM1616-6PIN; LCSC Part Name: 自弹式 MicroSIM卡 卡座; Supplier Part: C504015; Manufacturer Part: KH-SIM1616-6PIN; Supplier Footprint: SMD; JLCPCB Part Class: Extended Part; Datasheet: https://atta.szlcsc.com/upload/public/pdf/source/20200330/C504015_D42CE4BD6084CA1A3D8216E6E077CFDC.pdf; Supplier: LCSC; Convert to PCB: yes; Operating Temperature Range: -20℃~+60℃
Q1 Q2 = FFMT3905: TRANS PNP SOT23-3; Part Number: MMBTA92; Manufacturer: Diodes Incorporated; Manufacturer Part Number: MMBTA92-7-F; Current Footprint: TO-236-3, SC-59, SOT-23-3; Board Qty: 1000; PCB Name: GS-101; Current - Collector (Ic) (Max): 200mA; Frequency - Transition: 250MHz; ITEM/NO: 97; Category: Discrete Semiconductor Products; Mounting Type: Surface Mount; Transistor Type: PNP; Pricing: 1=0.24, 10=0.195, 100=0.1033, 500=0.06798, 1000=0.04623 (USD); HelpURL: D:\HNA\Datasheet Documents\ds30060.pdf; Size / Dimension: NULL; Base Part Number: MMBTA92; Package / Case: TO-236-3, SC-59, SOT-23-3; Packaging: Cut Tape (CT); Supplier: Digi-Key; Supplier Device Package: SOT-23-3; Supplier Part Number: MMBTA92-FDICT-ND
Q3-Q6 Q8-Q11 Q14 Q15 = BC817-40: TRANS NPN 300V 0.3A SOT23; Manufacturer: Micro Commercial Co; Manufacturer Part Number: MMBTA42-TP; Current Footprint: TO-236-3, SC-59, SOT-23-3; PCB Name: GS-101; Board Qty: 1000; ITEM/NO: 71; Vce Saturation (Max) @ Ib, Ic: 500mV @ 2mA, 20mA; DC Current Gain (hFE) (Min) @ Ic, Vce: 40 @ 30mA, 10V; Frequency - Transition: 50MHz; Current - Collector Cutoff (Max): 100nA (ICBO); HelpURL: D:\HNA\Datasheet Documents\MMBTA42(SOT-23).pdf; Part Number: BC817-40; Size / Dimension: NULL; Supplier: Digi-Key; Mounting Type: Surface Mount; Base Part Number: MMBTA42; Supplier Device Package: SOT-23; Part Status: Active; RoHS: RoHS Compliant; Category: Discrete Semiconductor Products; Supplier Part Number: MMBTA42TPMSCT-ND; Operating Temperature: -55°C ~ 150°C (TJ); Package / Case: TO-236-3, SC-59, SOT-23-3; Transistor Type: NPN; Packaging: Cut Tape (CT); Pricing: 1=0.22, 10=0.203, 25=0.146, 100=0.1136, 250=0.07136, 500=0.06084, 1000=0.04137 (USD); Stock: 49544
Q7 Q16 = IRLML6402TRPBF: P-Channel 20 V 3.7A (Ta) 1.3W (Ta) Surface Mount Micro3Ã¢â€žÂ¢ /SOT-23; MF: Infineon; SnapEDA_Link: https://www.snapeda.com/parts/IRLML6402TRPBF/Infineon/view-part/?ref=snap; Package: SOT-23-3 ON Semiconductor; Value: *; MP: IRLML6402TRPBF; Check_prices: https://www.snapeda.com/parts/IRLML6402TRPBF/Infineon/view-part/?ref=eda
Q12 = BC817-40: TRANS NPN 300V 0.3A SOT23; Part Number: MMBTA42; Manufacturer: Micro Commercial Co; Manufacturer Part Number: MMBTA42-TP; Current Footprint: TO-236-3, SC-59, SOT-23-3; PCB Name: GS-101; Board Qty: 1000; ITEM/NO: 71; Vce Saturation (Max) @ Ib, Ic: 500mV @ 2mA, 20mA; DC Current Gain (hFE) (Min) @ Ic, Vce: 40 @ 30mA, 10V; Frequency - Transition: 50MHz; Current - Collector Cutoff (Max): 100nA (ICBO); HelpURL: D:\HNA\Datasheet Documents\MMBTA42(SOT-23).pdf; Size / Dimension: NULL; Supplier: Digi-Key; Mounting Type: Surface Mount; Base Part Number: MMBTA42; Supplier Device Package: SOT-23; Part Status: Active; RoHS: RoHS Compliant; Category: Discrete Semiconductor Products; Supplier Part Number: MMBTA42TPMSCT-ND; Operating Temperature: -55°C ~ 150°C (TJ); Package / Case: TO-236-3, SC-59, SOT-23-3; Transistor Type: NPN; Packaging: Cut Tape (CT); Pricing: 1=0.22, 10=0.203, 25=0.146, 100=0.1136, 250=0.07136, 500=0.06084, 1000=0.04137 (USD); Stock: 49544
Q13 = AO3416: N-Channel 20 V 6.5A (Ta) 1.4W (Ta) Surface Mount SOT-23-3; MF: Alpha & Omega Semiconductor; SnapEDA_Link: https://www.snapeda.com/parts/AO3416/Alpha/view-part/?ref=snap; Package: SOT-23 Alpha &amp; Omega Semiconductor; Value: *; MP: AO3416; Check_prices: https://www.snapeda.com/parts/AO3416/Alpha/view-part/?ref=eda
R1 R14 R15 R37 R52 R53 = Res1: Resistor: thick film; SMD; Manufacturer: Vishay or Panasonic; Manufacturer Part Number: NULL; Board Qty: 1000; Current Footprint: 0603 (1608 Metric); Value: 1KR; PCB Name: GS-101; ITEM/NO: 56; ComponentLink1Description: Datasheet; ComponentLink1URL: D:\HNA\Datasheet Documents\Resistor-Chip-UniOhm.pdf; Description1: Resistor: thick film; SMD; HelpURL: D:\HNA\Datasheet Documents\Resistor-Chip-UniOhm.pdf; Mounting Type: Surface Mount, MLCC; Package / Case: 0603 (1608 Metric); Pricing: NULL; Supplier: NULL; Supplier Part Number: NULL; Size / Dimension: NULL
  R1: Part Number: 20KR
  R14 R37: Part Number: 100K
  R15: Part Number: 330R
  R52 R53: Part Number: 4.7K
R2 R16 R18 = Res1: Resistor: thick film; SMD; Part Number: 1KR; Manufacturer: Vishay or Panasonic; Manufacturer Part Number: NULL; Board Qty: 1000; Current Footprint: 0603 (1608 Metric); Value: 1KR; PCB Name: GS-101; ITEM/NO: 56; ComponentLink1Description: Datasheet; ComponentLink1URL: D:\HNA\Datasheet Documents\Resistor-Chip-UniOhm.pdf; Description1: Resistor: thick film; SMD; HelpURL: D:\HNA\Datasheet Documents\Resistor-Chip-UniOhm.pdf; Mounting Type: Surface Mount, MLCC; Package / Case: 0603 (1608 Metric); Pricing: NULL; Supplier: NULL; Supplier Part Number: NULL; Size / Dimension: NULL
R3 R24 = Res Semi: Resistor: thick film; SMD; Manufacturer: Vishay or Panasonic; Manufacturer Part Number: NULL; Current Footprint: 0603 (1608 Metric); Board Qty: 1000; PCB Name: GS-101; ITEM/NO: 47; Package / Case: 0603 (1608 Metric); Part Number: 100R; Pricing: NULL; Size / Dimension: NULL; Supplier: NULL; Supplier Part Number: NULL
R4 = Resistor SMD: Value: 100K
R5 = Resistor SMD: Value: 10K
R6 R25 R60 R75 = Res Semi: Resistor: thick film; SMD; Manufacturer: Vishay or Panasonic; Manufacturer Part Number: NULL; Part Number: 10KR; Current Footprint: 0603 (1608 Metric); Board Qty: 1000; PCB Name: GS-101; ITEM/NO: 20; Package / Case: 0603 (1608 Metric); Pricing: NULL; Size / Dimension: NULL; Supplier: NULL; Supplier Part Number: NULL
R7 R48 R57 = Res1: Resistor: thick film; SMD; Part Number: 1KR; Manufacturer: Vishay or Panasonic; Manufacturer Part Number: NULL; Board Qty: 1000; Current Footprint: 0603 (1608 Metric); Value: 4.7KR; PCB Name: GS-101; ITEM/NO: 15; ComponentLink1Description: Datasheet; ComponentLink1URL: D:\HNA\Datasheet Documents\Resistor-Chip-UniOhm.pdf; Description1: Resistor: thick film; SMD; HelpURL: D:\HNA\Datasheet Documents\Resistor-Chip-UniOhm.pdf; Mounting Type: Surface Mount, MLCC; Package / Case: 0603 (1608 Metric); Pricing: NULL; Supplier: NULL; Supplier Part Number: NULL; Size / Dimension: NULL
R8 R12 = Res Semi: Resistor: thick film; SMD; Manufacturer: Vishay or Panasonic; Manufacturer Part Number: NULL; Part Number: 10KR; Current Footprint: 0603 (1608 Metric); Board Qty: 1000; PCB Name: GS-101; ITEM/NO: 50; Package / Case: 0603 (1608 Metric); Pricing: NULL; Size / Dimension: NULL; Supplier: NULL; Supplier Part Number: NULL
R9 = Resistor SMD: Value: 5.1K
R10 R20#1 = Resistor SMD
  R10: Value: 511K
  R20#1: Value: 105K
R11 R31 R34 = Res1: Resistor: thick film; SMD; Manufacturer: Vishay or Panasonic; Manufacturer Part Number: NULL; Board Qty: 1000; Current Footprint: 0603 (1608 Metric); Value: 4.7KR; PCB Name: GS-101; ITEM/NO: 47; ComponentLink1Description: Datasheet; ComponentLink1URL: D:\HNA\Datasheet Documents\Resistor-Chip-UniOhm.pdf; Description1: Resistor: thick film; SMD; HelpURL: D:\HNA\Datasheet Documents\Resistor-Chip-UniOhm.pdf; Mounting Type: Surface Mount, MLCC; Package / Case: 0603 (1608 Metric); Pricing: NULL; Supplier: NULL; Supplier Part Number: NULL; Size / Dimension: NULL
  R11: Part Number: 0R
  R31 R34: Part Number: 100R
R13 R23 R26 R28 = Res Semi: Resistor: thick film; SMD; Manufacturer: Vishay or Panasonic; Manufacturer Part Number: NULL; Part Number: 4.7KR; Current Footprint: 0603 (1608 Metric); Board Qty: 1000; PCB Name: GS-101; ITEM/NO: 15; Package / Case: 0603 (1608 Metric); Pricing: NULL; Size / Dimension: NULL; Supplier: NULL; Supplier Part Number: NULL
R20#2 = Res1: Resistor: thick film; SMD; Part Number: 0R; Manufacturer: Vishay or Panasonic; Manufacturer Part Number: NULL; Board Qty: 1000; Current Footprint: 0603 (1608 Metric); Value: 4.7KR; PCB Name: GS-101; ITEM/NO: 15; ComponentLink1Description: Datasheet; ComponentLink1URL: D:\HNA\Datasheet Documents\Resistor-Chip-UniOhm.pdf; Description1: Resistor: thick film; SMD; HelpURL: D:\HNA\Datasheet Documents\Resistor-Chip-UniOhm.pdf; Mounting Type: Surface Mount, MLCC; Package / Case: 0603 (1608 Metric); Pricing: NULL; Supplier: NULL; Supplier Part Number: NULL; Size / Dimension: NULL
R21 = Res1: Resistor: thick film; SMD; Part Number: 4.7KR; Manufacturer: Vishay or Panasonic; Manufacturer Part Number: NULL; Board Qty: 1000; Current Footprint: 0603 (1608 Metric); Value: 4.7KR; PCB Name: GS-101; ITEM/NO: 15; ComponentLink1Description: Datasheet; ComponentLink1URL: D:\HNA\Datasheet Documents\Resistor-Chip-UniOhm.pdf; Description1: Resistor: thick film; SMD; HelpURL: D:\HNA\Datasheet Documents\Resistor-Chip-UniOhm.pdf; Mounting Type: Surface Mount, MLCC; Package / Case: 0603 (1608 Metric); Pricing: NULL; Supplier: NULL; Supplier Part Number: NULL; Size / Dimension: NULL
R22 R27 = Res Semi: Resistor: thick film; SMD; Manufacturer: Vishay or Panasonic; Manufacturer Part Number: NULL; Part Number: 1KR; Current Footprint: 0603 (1608 Metric); Board Qty: 1000; PCB Name: GS-101; ITEM/NO: 50; Package / Case: 0603 (1608 Metric); Pricing: NULL; Size / Dimension: NULL; Supplier: NULL; Supplier Part Number: NULL
R29 R35 = Res1: Resistor: thick film; SMD; Part Number: 47KR; Manufacturer: Vishay or Panasonic; Manufacturer Part Number: NULL; Board Qty: 1000; Current Footprint: 0603 (1608 Metric); Value: 4.7KR; PCB Name: GS-101; ITEM/NO: 39; ComponentLink1Description: Datasheet; ComponentLink1URL: D:\HNA\Datasheet Documents\Resistor-Chip-UniOhm.pdf; Description1: Resistor: thick film; SMD; HelpURL: D:\HNA\Datasheet Documents\Resistor-Chip-UniOhm.pdf; Mounting Type: Surface Mount, MLCC; Package / Case: 0603 (1608 Metric); Pricing: NULL; Supplier: NULL; Supplier Part Number: NULL; Size / Dimension: NULL
R30 R49 R69 = Res1: Resistor: thick film; SMD; Part Number: 3.3KR; Manufacturer: Vishay or Panasonic; Manufacturer Part Number: NULL; Board Qty: 1000; Current Footprint: 0603 (1608 Metric); Value: 4.7KR; PCB Name: GS-101; ITEM/NO: 15; ComponentLink1Description: Datasheet; ComponentLink1URL: D:\HNA\Datasheet Documents\Resistor-Chip-UniOhm.pdf; Description1: Resistor: thick film; SMD; HelpURL: D:\HNA\Datasheet Documents\Resistor-Chip-UniOhm.pdf; Mounting Type: Surface Mount, MLCC; Package / Case: 0603 (1608 Metric); Pricing: NULL; Supplier: NULL; Supplier Part Number: NULL; Size / Dimension: NULL
R39 = Res1: Resistor: thick film; SMD; Part Number: 100; Manufacturer: Vishay or Panasonic; Manufacturer Part Number: NULL; Board Qty: 1000; Current Footprint: 0603 (1608 Metric); Value: 100; PCB Name: GS-101; ITEM/NO: 56; ComponentLink1Description: Datasheet; ComponentLink1URL: D:\HNA\Datasheet Documents\Resistor-Chip-UniOhm.pdf; Description1: Resistor: thick film; SMD; HelpURL: D:\HNA\Datasheet Documents\Resistor-Chip-UniOhm.pdf; Mounting Type: Surface Mount, MLCC; Package / Case: 0603 (1608 Metric); Pricing: NULL; Supplier: NULL; Supplier Part Number: NULL; Size / Dimension: NULL
R40 = Res1: Resistor: thick film; SMD; Part Number: 10KR; Manufacturer: Vishay or Panasonic; Manufacturer Part Number: NULL; Board Qty: 1000; Current Footprint: 0603 (1608 Metric); Value: 1KR; PCB Name: GS-101; ITEM/NO: 56; ComponentLink1Description: Datasheet; ComponentLink1URL: D:\HNA\Datasheet Documents\Resistor-Chip-UniOhm.pdf; Description1: Resistor: thick film; SMD; HelpURL: D:\HNA\Datasheet Documents\Resistor-Chip-UniOhm.pdf; Mounting Type: Surface Mount, MLCC; Package / Case: 0603 (1608 Metric); Pricing: NULL; Supplier: NULL; Supplier Part Number: NULL; Size / Dimension: NULL
R41 = Res1: Resistor: thick film; SMD; Part Number: 0; Manufacturer: Vishay or Panasonic; Manufacturer Part Number: NULL; Board Qty: 1000; Current Footprint: 0603 (1608 Metric); Value: 1KR; PCB Name: GS-101; ITEM/NO: 56; ComponentLink1Description: Datasheet; ComponentLink1URL: D:\HNA\Datasheet Documents\Resistor-Chip-UniOhm.pdf; Description1: Resistor: thick film; SMD; HelpURL: D:\HNA\Datasheet Documents\Resistor-Chip-UniOhm.pdf; Mounting Type: Surface Mount, MLCC; Package / Case: 0603 (1608 Metric); Pricing: NULL; Supplier: NULL; Supplier Part Number: NULL; Size / Dimension: NULL
R43 R45 = Res SMD: Resistor: thick film; SMD; Manufacturer: Vishay or Panasonic; Manufacturer Part Number: NULL; Current Footprint: 0603 (1608 Metric); Board Qty: 1000; PCB Name: GS-101; ITEM/NO: 39; Package / Case: 0603 (1608 Metric); Part Number: 47KR/ 1%; Pricing: NULL; Size / Dimension: NULL; Supplier: NULL; Supplier Part Number: NULL
R44 = Res SMD: Resistor: thick film; SMD; Manufacturer: Vishay or Panasonic; Manufacturer Part Number: NULL; Part Number: 10KR; Current Footprint: 0603 (1608 Metric); Board Qty: 1000; PCB Name: GS-101; ITEM/NO: 20; Package / Case: 0603 (1608 Metric); Pricing: NULL; Size / Dimension: NULL; Supplier: NULL; Supplier Part Number: NULL
R46 R47 R50 R51 R73 R76 = Res1: Resistor: thick film; SMD; Part Number: 10KR; Manufacturer: Vishay or Panasonic; Manufacturer Part Number: NULL; Board Qty: 1000; Current Footprint: 0603 (1608 Metric); Value: 4.7KR; PCB Name: GS-101; ITEM/NO: 20; ComponentLink1Description: Datasheet; ComponentLink1URL: D:\HNA\Datasheet Documents\Resistor-Chip-UniOhm.pdf; Description1: Resistor: thick film; SMD; HelpURL: D:\HNA\Datasheet Documents\Resistor-Chip-UniOhm.pdf; Mounting Type: Surface Mount, MLCC; Package / Case: 0603 (1608 Metric); Pricing: NULL; Supplier: NULL; Supplier Part Number: NULL; Size / Dimension: NULL
R68 = Res Semi: Resistor: thick film; SMD; Manufacturer: Vishay or Panasonic; Manufacturer Part Number: NULL; Current Footprint: 0603 (1608 Metric); Board Qty: 1000; PCB Name: GS-101; ITEM/NO: 50; Package / Case: 0603 (1608 Metric); Part Number: 120R; Pricing: NULL; Size / Dimension: NULL; Supplier: NULL; Supplier Part Number: NULL
R72 = Res Semi: Resistor: thick film; SMD; Manufacturer: Vishay or Panasonic; Manufacturer Part Number: NULL; Part Number: 47KR; Current Footprint: 0603 (1608 Metric); Board Qty: 1000; PCB Name: GS-101; ITEM/NO: 43; Package / Case: 0603 (1608 Metric); Pricing: NULL; Size / Dimension: NULL; Supplier: NULL; Supplier Part Number: NULL
S1 = SW-SPDT: SWITCH SLIDE SPDT; Manufacturer: APEM Inc.; Manufacturer Part Number: MA12RTR; Contact Timing: Not Specified; Switch Function: On-On; Current Rating: 300mA (DC); Actuator Type: Standard; Actuator Length: 1.50mm; Actuator Material: Liquid Crystal Polymer (LCP); Electrical Life: 10,000 Cycles; Operating Force: 200gf; Supplier 1: Digi-Key; Supplier Part Number 1: 679-1847-2-ND; RoHS: RoHS Compliant; Category: Switches; Stock 1: 13200; Pricing 1: 3300=0.5504, 6600=0.4816, 23100=0.4128 (USD); Packaging: Tape & Reel (TR); Part Status: Active; Circuit: SPDT; Contact Material: Beryllium Copper; Contact Finish: Silver; Mounting Type: Surface Mount, Right Angle; Termination Style: Gull Wing; Features: Board Guide; Switch Travel: 1.50mm; Operating Temperature: -10°C ~ 60°C; Mechanical Life: -; ComponentLink1URL: http://media.digikey.com/pdf/Data%20Sheets/APEM%20Components%20PDFs/MA_Series_.pdf; ComponentLink1Description: http://media.digikey.com/pdf/Data%20Sheets/APEM%20Components%20PDFs/MA_Series_.pdf; Part Number: MA12RTR; HelpURL: D:\HNA\Datasheet Documents\MA_Series_.pdf
U1 = TP4056: Complete single cell Li-Ion battery with a constant current / constant voltage linear charger; MF: NanJing Top Power ASIC Corp.; Check_prices: https://www.snapeda.com/parts/TP4056/NanJing+Top+Power+ASIC+Corp./view-part/?ref=eda; SnapEDA_Link: https://www.snapeda.com/parts/TP4056/NanJing+Top+Power+ASIC+Corp./view-part/?ref=snap; Price: None; Availability: Not in stock; Package: Package; MP: TP4056; Value: *
U2 = SKC111: GSM/GPRS/GNSS Module Series; Current Footprint: MOD-68; Board Qty: 1000; ITEM/NO: NULL; PCB Name: GS-101; HelpURL: D:\HNA\ALTIUM2009\GS-101\Quictel\MC60\MC60\Hardware\Quectel_MC60_Series_Hardware_Design_V2.0.pdf; Part Number: MC60; Package / Case: MOD-68; Manufacturer Part Number: NULL; Pricing: NULL; Size / Dimension: NULL; Supplier: NULL; Supplier Part Number: NULL; Manufacturer: NULL
U3 = LIS3DHTR: MEMS digital output motion sensor: Ultra low-power high performance 3-axis nano accelerometer, -40 to +85°C, LGA-16 (3x3x1), Tape and Reel; Manufacturer: STMicroelectronics; Current Footprint: LGA16-3X3X1_N; Board Qty: 1000; PCB Name: GS-101; ITEM/NO: 90; ComponentLink1Description: Manufacturer URL; ComponentLink1URL: http://www.st.com/; Manufacturer Part Number: LIS3DHTR; Mounting Type: Surface Mount; Package / Case: 16-VFLGA; Supplier: Digi-Key; Supplier Part Number: 497-10613-1-ND; Pricing: 1=1.63, 10=1.463, 100=1.1738, 500=0.9648, 1000=0.79864 (USD); Part Number: LIS3DHTR; Size / Dimension: NULL; HelpURL: D:\HNA\Datasheet Documents\en.CD00274221.pdf
U4 = TPS54202DDC: 4.5V to 28V Input, 2-A Output, EMI Friendly / Synchronous Step Down Converter; Part Description: 4.5V to 28V Input, 2A Output, EMI Friendly Synchronous Step Down Converter; Manufacturer: TEXAS INSTRUMENTS; PressFit: No; Bonding: No; Part Number: TPS54202DDC; Component Kind: Standard; Component Type: Standard; Device: TPS54202DDC; PackageDescription: SOT23, 0.95mm Pitch; 6 Pin, 1.625mm W X 2.90mm L X 1.00mm H body, IPC Medium Density; Manufacturer Part Number: TPS54202DDC; Pin Count: 5; Case: SOT23-6; Mounted: Yes; Socket: No; SMD: Yes; Sense: No; ComponentHeight: 1.1mm; HelpURL: \\cern.ch\dfs\Applications\Altium\Datasheets\TPS54202.pdf; Author: CERN DEM HF; CreateDate: 6/10/2022; LatestRevisionDate: 6/10/2022
U5 = SGM2019A: Fixed LDO Voltage Regulator 3.3V 300mA SOT-23-5; Manufacturer: SG Micro Limited; Description1: Low Power, Low Dropout  RF-Linear Regulator; Board Qty: 1000; PCB Name: GS-101; ITEM/NO: 106; Current Footprint: SOT23-5; Manufacturer Part Number: SGM2019A; Package / Case: SOT23-5; Part Number: TLV74333PDBVR; Pricing: NULL; Size / Dimension: NULL; Supplier: NULL; Supplier Part Number: NULL; HelpURL: D:\HNA\Datasheet Documents\SGM2019 (YJAA SMD CODE).pdf
U6 = TPS3823-33DBVR: Active-low, push-pull, voltage supervisor (reset IC) with 1.6-s watchdog & manual reset; MF: Texas Instruments; SnapEDA_Link: https://www.snapeda.com/parts/TPS3823-33DBVR/Texas+Instruments/view-part/?ref=snap; Package: SOT-23-5 Texas Instruments; Value: *; MP: TPS3823-33DBVR; Check_prices: https://www.snapeda.com/parts/TPS3823-33DBVR/Texas+Instruments/view-part/?ref=eda